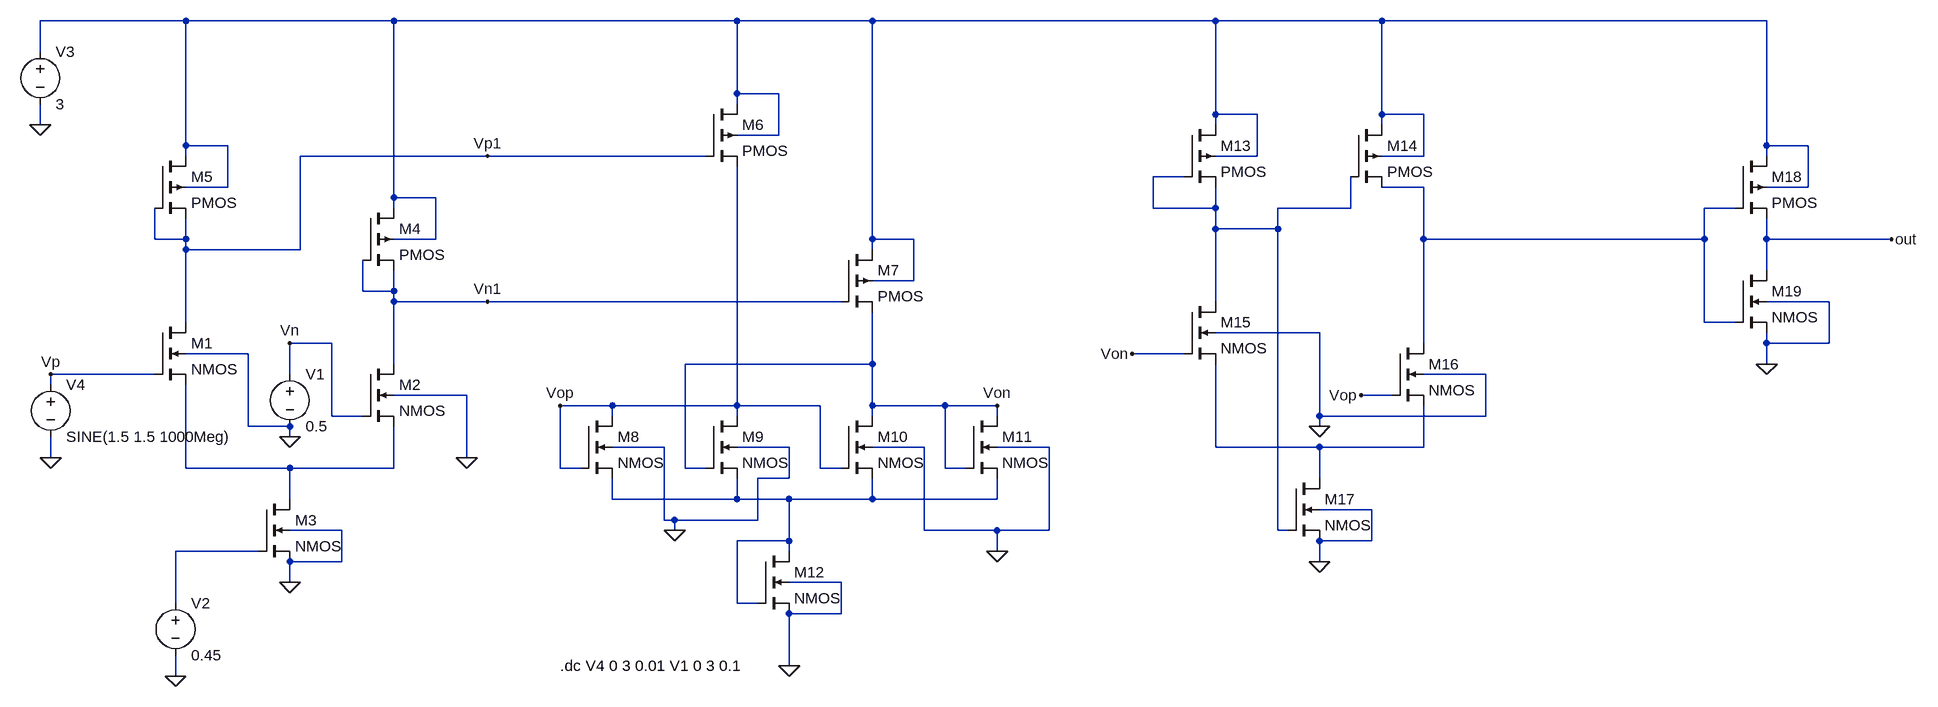
[diagram p0: schematic comparator.asc]
comparator.asc, the LTspice schematic file:
Version 4
SHEET 1 2824 740
WIRE 144 -368 -80 -368
WIRE 464 -368 144 -368
WIRE 992 -368 464 -368
WIRE 1200 -368 992 -368
WIRE 1728 -368 1200 -368
WIRE 1984 -368 1728 -368
WIRE 2576 -368 1984 -368
WIRE -80 -320 -80 -368
WIRE 992 -256 992 -368
WIRE 1056 -256 992 -256
WIRE 992 -240 992 -256
WIRE 1728 -224 1728 -368
WIRE 1792 -224 1728 -224
WIRE 1984 -224 1984 -368
WIRE 2048 -224 1984 -224
WIRE -80 -208 -80 -240
WIRE 1728 -208 1728 -224
WIRE 1984 -208 1984 -224
WIRE 1056 -192 1056 -256
WIRE 1056 -192 992 -192
WIRE 144 -176 144 -368
WIRE 208 -176 144 -176
WIRE 2576 -176 2576 -368
WIRE 2640 -176 2576 -176
WIRE 144 -160 144 -176
WIRE 608 -160 320 -160
WIRE 944 -160 608 -160
WIRE 1792 -160 1792 -224
WIRE 1792 -160 1728 -160
WIRE 2048 -160 2048 -224
WIRE 2048 -160 1984 -160
WIRE 2576 -160 2576 -176
WIRE 1680 -128 1632 -128
WIRE 208 -112 208 -176
WIRE 208 -112 144 -112
WIRE 2048 -112 1984 -112
WIRE 2640 -112 2640 -176
WIRE 2640 -112 2576 -112
WIRE 464 -96 464 -368
WIRE 528 -96 464 -96
WIRE 464 -80 464 -96
WIRE 1632 -80 1632 -128
WIRE 1728 -80 1728 -112
WIRE 1728 -80 1632 -80
WIRE 1936 -80 1936 -128
WIRE 1936 -80 1824 -80
WIRE 2528 -80 2480 -80
WIRE 1728 -48 1728 -80
WIRE 1824 -48 1824 -80
WIRE 1824 -48 1728 -48
WIRE 96 -32 96 -80
WIRE 144 -32 144 -64
WIRE 144 -32 96 -32
WIRE 528 -32 528 -96
WIRE 528 -32 464 -32
WIRE 1200 -32 1200 -368
WIRE 1264 -32 1200 -32
WIRE 2048 -32 2048 -112
WIRE 2480 -32 2480 -80
WIRE 2480 -32 2048 -32
WIRE 2576 -32 2576 -64
WIRE 2768 -32 2576 -32
WIRE 144 -16 144 -32
WIRE 320 -16 320 -160
WIRE 320 -16 144 -16
WIRE 1200 -16 1200 -32
WIRE 2576 16 2576 -32
WIRE 1264 32 1264 -32
WIRE 1264 32 1200 32
WIRE 416 48 416 0
WIRE 464 48 464 16
WIRE 464 48 416 48
WIRE 464 64 464 48
WIRE 608 64 464 64
WIRE 1152 64 608 64
WIRE 1728 64 1728 -48
WIRE 2672 64 2576 64
WIRE 144 96 144 -16
WIRE 2480 96 2480 -32
WIRE 2528 96 2480 96
WIRE 1888 112 1728 112
WIRE 368 128 304 128
WIRE 2048 128 2048 -32
WIRE 2576 128 2576 112
WIRE 2672 128 2672 64
WIRE 2672 128 2576 128
WIRE 240 144 144 144
WIRE 1680 144 1600 144
WIRE 464 160 464 64
WIRE 1200 160 1200 80
WIRE 1200 160 912 160
WIRE 2576 160 2576 128
WIRE 96 176 -64 176
WIRE 304 176 304 128
WIRE 2144 176 2048 176
WIRE -64 192 -64 176
WIRE 576 208 464 208
WIRE 2000 208 1952 208
WIRE 800 224 720 224
WIRE 992 224 992 -144
WIRE 992 224 800 224
WIRE 1120 224 992 224
WIRE 1200 224 1200 160
WIRE 1312 224 1200 224
WIRE 1392 224 1312 224
WIRE 368 240 368 128
WIRE 416 240 368 240
WIRE 800 240 800 224
WIRE 992 240 992 224
WIRE 1200 240 1200 224
WIRE 1392 240 1392 224
WIRE 1888 240 1888 112
WIRE 2144 240 2144 176
WIRE 2144 240 1888 240
WIRE 240 256 240 144
WIRE 304 256 240 256
WIRE 1888 256 1888 240
WIRE 304 272 304 256
WIRE 880 288 800 288
WIRE 1072 288 992 288
WIRE 1280 288 1200 288
WIRE 1472 288 1392 288
WIRE 1728 288 1728 160
WIRE 1888 288 1728 288
WIRE 2048 288 2048 224
WIRE 2048 288 1888 288
WIRE -64 304 -64 272
WIRE 576 304 576 208
WIRE 144 320 144 192
WIRE 304 320 144 320
WIRE 464 320 464 256
WIRE 464 320 304 320
WIRE 720 320 720 224
WIRE 752 320 720 320
WIRE 912 320 912 160
WIRE 944 320 912 320
WIRE 1120 320 1120 224
WIRE 1152 320 1120 320
WIRE 1312 320 1312 224
WIRE 1344 320 1312 320
WIRE 1072 336 1072 288
WIRE 1072 336 1024 336
WIRE 1888 336 1888 288
WIRE 304 368 304 320
WIRE 800 368 800 336
WIRE 992 368 992 336
WIRE 992 368 800 368
WIRE 1072 368 992 368
WIRE 1200 368 1200 336
WIRE 1200 368 1072 368
WIRE 1392 368 1392 336
WIRE 1392 368 1200 368
WIRE 1968 384 1888 384
WIRE 880 400 880 288
WIRE 896 400 880 400
WIRE 1024 400 1024 336
WIRE 1024 400 896 400
WIRE 384 416 304 416
WIRE 896 416 896 400
WIRE 1280 416 1280 288
WIRE 1392 416 1280 416
WIRE 1472 416 1472 288
WIRE 1472 416 1392 416
WIRE 1824 416 1824 -48
WIRE 1840 416 1824 416
WIRE 1072 432 1072 368
WIRE 1072 432 992 432
WIRE 1968 432 1968 384
WIRE 1968 432 1888 432
WIRE 256 448 128 448
WIRE 1072 448 1072 432
WIRE 1392 448 1392 416
WIRE 384 464 384 416
WIRE 384 464 304 464
WIRE 1888 464 1888 432
WIRE 304 496 304 464
WIRE 1152 496 1072 496
WIRE 128 528 128 448
WIRE 992 528 992 432
WIRE 1024 528 992 528
WIRE 1152 544 1152 496
WIRE 1152 544 1072 544
WIRE 1072 624 1072 544
WIRE 128 640 128 608
FLAG 304 496 0
FLAG 128 640 0
FLAG 304 272 0
FLAG 576 304 0
FLAG -80 -208 0
FLAG -64 304 0
FLAG -64 176 Vp
FLAG 304 128 Vn
FLAG 608 -160 Vp1
FLAG 608 64 Vn1
FLAG 1072 624 0
FLAG 720 224 Vop
FLAG 1392 224 Von
FLAG 1888 464 0
FLAG 1888 256 0
FLAG 1600 144 Von
FLAG 1952 208 Vop
FLAG 2576 160 0
FLAG 2768 -32 out
FLAG 1392 448 0
FLAG 896 416 0
SYMBOL nmos4 96 96 R0
SYMATTR InstName M1
SYMATTR Value2 l=2 w=10
SYMBOL nmos4 416 160 R0
SYMATTR InstName M2
SYMATTR Value2 l=2 w=10
SYMBOL nmos4 256 368 R0
SYMATTR InstName M3
SYMATTR Value2 l=2u w=40u
SYMBOL voltage 304 160 R0
WINDOW 123 0 0 Left 0
WINDOW 39 0 0 Left 0
SYMATTR InstName V1
SYMATTR Value 0.5
SYMBOL voltage 128 512 R0
WINDOW 123 0 0 Left 0
WINDOW 39 0 0 Left 0
SYMATTR InstName V2
SYMATTR Value 0.45
SYMBOL pmos4 416 -80 R0
SYMATTR InstName M4
SYMATTR Value2 l=2 w=30
SYMBOL pmos4 96 -160 R0
SYMATTR InstName M5
SYMATTR Value2 l=2 w=30
SYMBOL voltage -80 -336 R0
WINDOW 123 0 0 Left 0
WINDOW 39 0 0 Left 0
SYMATTR InstName V3
SYMATTR Value 3
SYMBOL voltage -64 176 R0
WINDOW 123 0 0 Left 0
WINDOW 39 0 0 Left 0
SYMATTR InstName V4
SYMATTR Value SINE(1.5 1.5 1000Meg)
SYMBOL pmos4 944 -240 R0
SYMATTR InstName M6
SYMATTR Value2 l=2 w=30
SYMBOL pmos4 1152 -16 R0
SYMATTR InstName M7
SYMATTR Value2 l=2 w=30
SYMBOL nmos4 752 240 R0
SYMATTR InstName M8
SYMATTR Value2 l=2 w=10
SYMBOL nmos4 944 240 R0
SYMATTR InstName M9
SYMATTR Value2 l=2 w=10
SYMBOL nmos4 1152 240 R0
SYMATTR InstName M10
SYMATTR Value2 l=2 w=10
SYMBOL nmos4 1344 240 R0
SYMATTR InstName M11
SYMATTR Value2 l=2 w=10
SYMBOL nmos4 1024 448 R0
SYMATTR InstName M12
SYMATTR Value2 l=2 w=10
SYMBOL pmos4 1680 -208 R0
SYMATTR InstName M13
SYMATTR Value2 l=2 w=30
SYMBOL pmos4 1936 -208 R0
SYMATTR InstName M14
SYMATTR Value2 l=2 w=30
SYMBOL nmos4 1680 64 R0
SYMATTR InstName M15
SYMATTR Value2 l=2 w=10
SYMBOL nmos4 2000 128 R0
SYMATTR InstName M16
SYMATTR Value2 l=2 w=10
SYMBOL nmos4 1840 336 R0
SYMATTR InstName M17
SYMATTR Value2 l=2u w=40u
SYMBOL pmos4 2528 -160 R0
SYMATTR InstName M18
SYMATTR Value2 l=2 w=30
SYMBOL nmos4 2528 16 R0
SYMATTR InstName M19
SYMATTR Value2 l=2 w=10
TEXT 720 624 Left 2 !.dc V4 0 3 0.01 V1 0 3 0.1

The netlist it stands for:
* comparator.asc
M1 Vp1 Vp N005 0 NMOS l=2 w=10
M2 Vn1 Vn N005 0 NMOS l=2 w=10
M3 N005 N007 0 0 NMOS l=2u w=40u
V1 Vn 0 0.5
V2 N007 0 0.45
M4 N001 Vn1 Vn1 N001 PMOS l=2 w=30
M5 N001 Vp1 Vp1 N001 PMOS l=2 w=30
V3 N001 0 3
V4 Vp 0 SINE(1.5 1.5 1000Meg)
M6 N001 Vp1 Vop N001 PMOS l=2 w=30
M7 N001 Vn1 Von N001 PMOS l=2 w=30
M8 Vop Vop N006 0 NMOS l=2 w=10
M9 Vop Von N006 0 NMOS l=2 w=10
M10 Von Vop N006 0 NMOS l=2 w=10
M11 Von Von N006 0 NMOS l=2 w=10
M12 N006 N006 0 0 NMOS l=2 w=10
M13 N001 N002 N002 N001 PMOS l=2 w=30
M14 N001 N002 N003 N001 PMOS l=2 w=30
M15 N002 Von N004 0 NMOS l=2 w=10
M16 N003 Vop N004 0 NMOS l=2 w=10
M17 N004 N002 0 0 NMOS l=2u w=40u
M18 N001 N003 out N001 PMOS l=2 w=30
M19 out N003 0 0 NMOS l=2 w=10
.model NMOS NMOS
.model PMOS PMOS
.lib standard.mos
.dc V4 0 3 0.01 V1 0 3 0.1
.backanno
.end